# Altium schematic sheet Break Light Schematic.SchDoc
size 381 x 241 mm
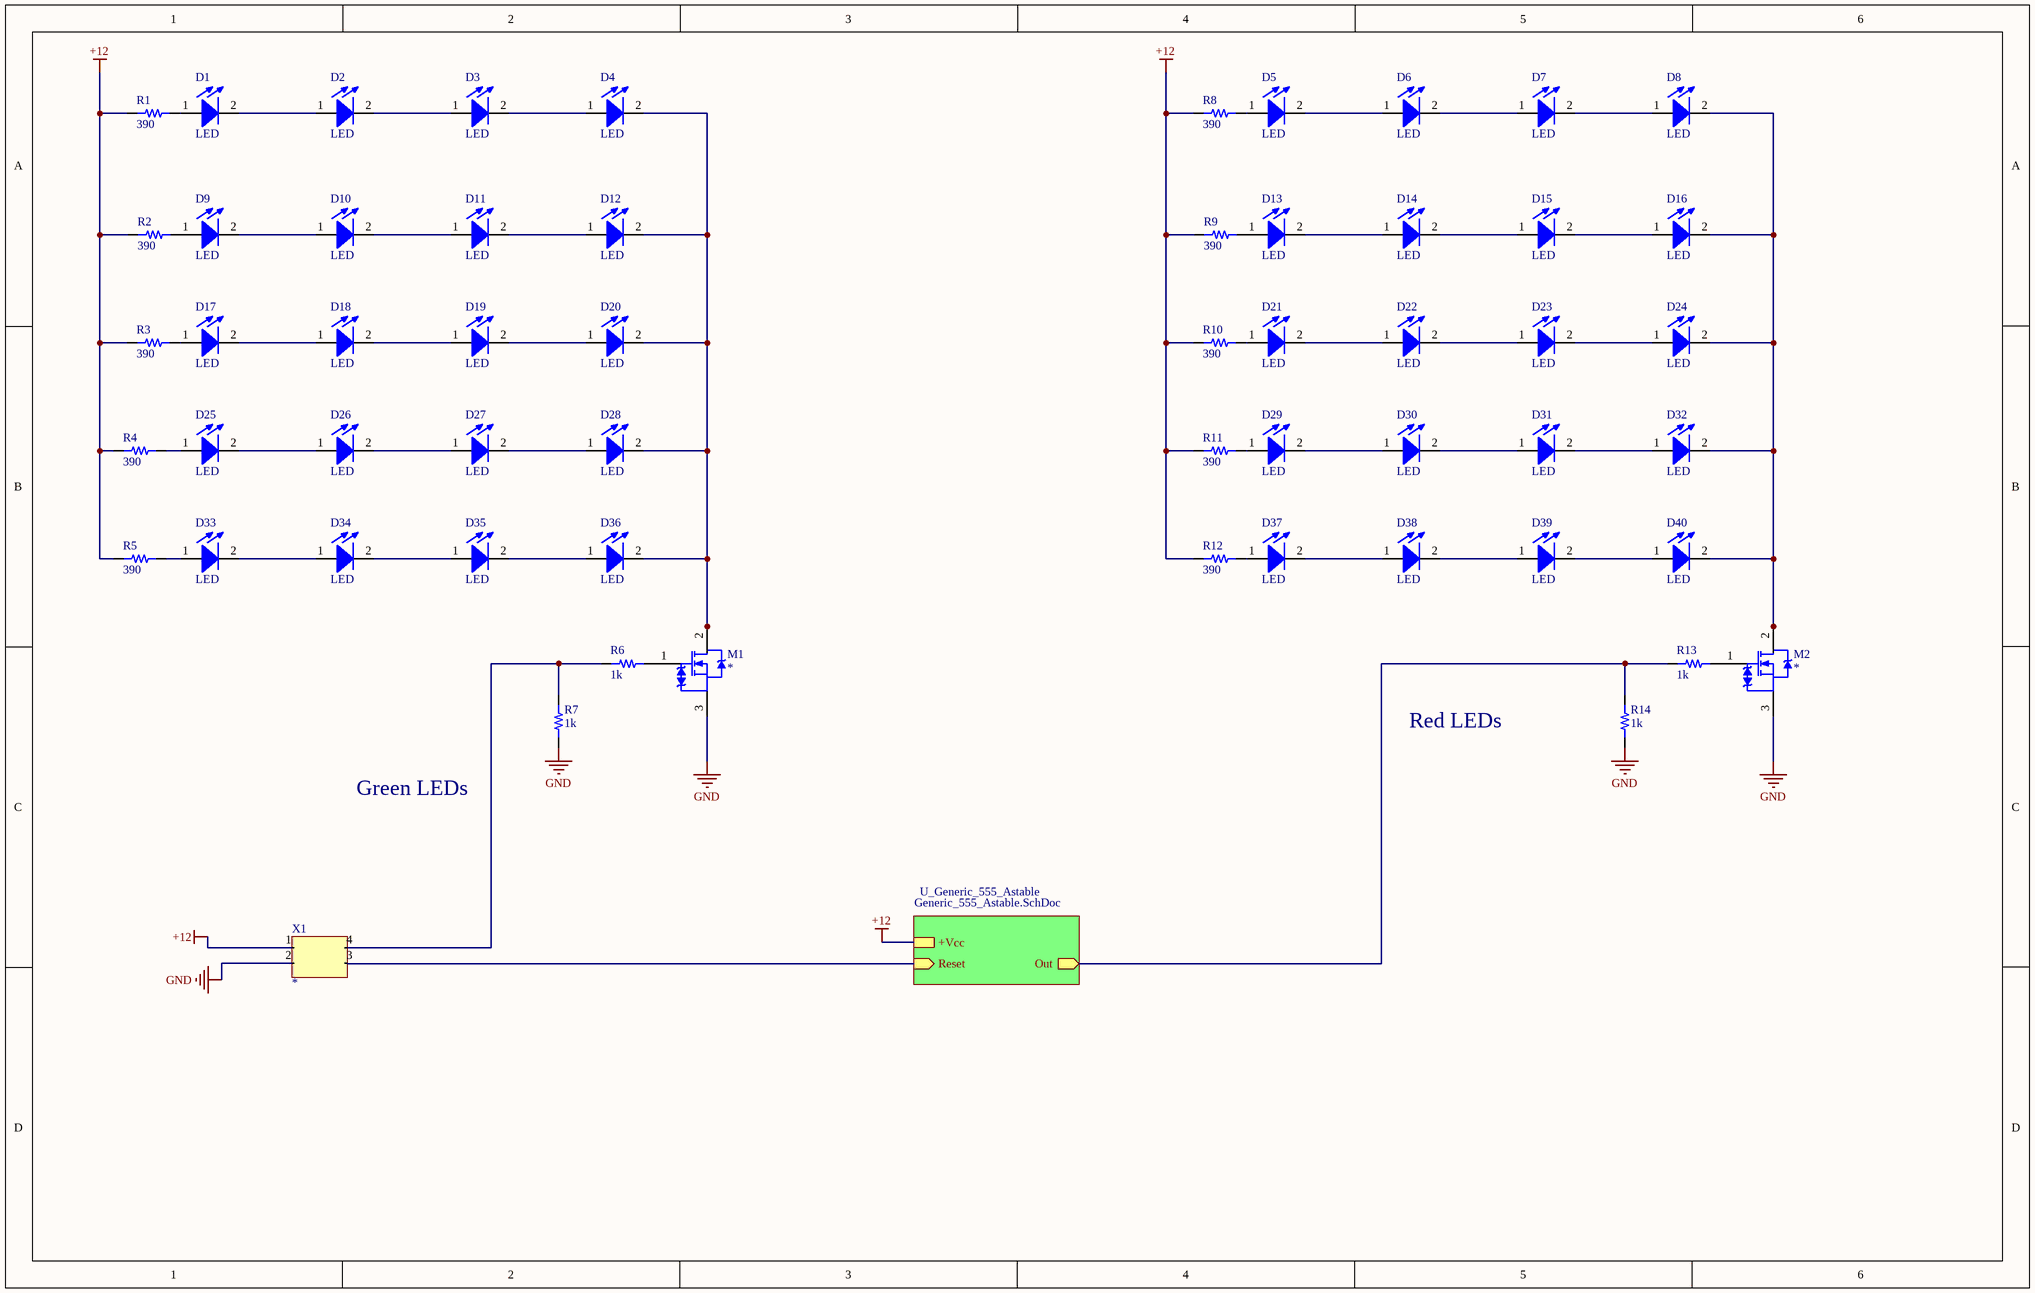
[diagram p0: Break Light Schematic.SchDoc]

## Parts
D1  LED  [LED TH]
D2  LED  [LED TH]
D3  LED  [LED TH]
D4  LED  [LED TH]
D5  LED  [LED TH]
D6  LED  [LED TH]
D7  LED  [LED TH]
D8  LED  [LED TH]
D9  LED  [LED TH]
D10  LED  [LED TH]
D11  LED  [LED TH]
D12  LED  [LED TH]
D13  LED  [LED TH]
D14  LED  [LED TH]
D15  LED  [LED TH]
D16  LED  [LED TH]
D17  LED  [LED TH]
D18  LED  [LED TH]
D19  LED  [LED TH]
D20  LED  [LED TH]
D21  LED  [LED TH]
D22  LED  [LED TH]
D23  LED  [LED TH]
D24  LED  [LED TH]
D25  LED  [LED TH]
D26  LED  [LED TH]
D27  LED  [LED TH]
D28  LED  [LED TH]
D29  LED  [LED TH]
D30  LED  [LED TH]
D31  LED  [LED TH]
D32  LED  [LED TH]
D33  LED  [LED TH]
D34  LED  [LED TH]
D35  LED  [LED TH]
D36  LED  [LED TH]
D37  LED  [LED TH]
D38  LED  [LED TH]
D39  LED  [LED TH]
D40  LED  [LED TH]
M1  *  [SOT-223-3]
M2  *  [SOT-223-3]
R1  390  [RES 0603/1608]
R2  390  [RES 0603/1608]
R3  390  [RES 0603/1608]
R4  390  [RES 0603/1608]
R5  390  [RES 0603/1608]
R6  1k  [RES 0603/1608]
R7  1k  [RES 0603/1608]
R8  390  [RES 0603/1608]
R9  390  [RES 0603/1608]
R10  390  [RES 0603/1608]
R11  390  [RES 0603/1608]
R12  390  [RES 0603/1608]
R13  1k  [RES 0603/1608]
R14  1k  [RES 0603/1608]
X1  *  [DT15-4P]

## Sub-sheets
U_Generic_555_Astable = Generic_555_Astable.SchDoc: +Vcc, Out (out), Reset (in)

## Nets
+12: R1.1 R2.1 R3.1 R4.1 R5.1 R8.1 R9.1 R10.1 R11.1 R12.1 X1.1 ; sheet U_Generic_555_Astable/+Vcc
GND: M1.3(S) M2.3(S) R7.1 R14.1 X1.2
NetD1_1: D1.1(A) R1.2
NetD1_2: D1.2(K) D2.1(A)
NetD2_2: D2.2(K) D3.1(A)
NetD3_2: D3.2(K) D4.1(A)
NetD4_2: D4.2(K) D12.2(K) D20.2(K) D28.2(K) D36.2(K) M1.2(D) M1.THM(D)
NetD5_1: D5.1(A) R8.2
NetD5_2: D5.2(K) D6.1(A)
NetD6_2: D6.2(K) D7.1(A)
NetD7_2: D7.2(K) D8.1(A)
NetD8_2: D8.2(K) D16.2(K) D24.2(K) D32.2(K) D40.2(K) M2.2(D) M2.THM(D)
NetD9_1: D9.1(A) R2.2
NetD9_2: D9.2(K) D10.1(A)
NetD10_2: D10.2(K) D11.1(A)
NetD11_2: D11.2(K) D12.1(A)
NetD13_1: D13.1(A) R9.2
NetD13_2: D13.2(K) D14.1(A)
NetD14_2: D14.2(K) D15.1(A)
NetD15_2: D15.2(K) D16.1(A)
NetD17_1: D17.1(A) R3.2
NetD17_2: D17.2(K) D18.1(A)
NetD18_2: D18.2(K) D19.1(A)
NetD19_2: D19.2(K) D20.1(A)
NetD21_1: D21.1(A) R10.2
NetD21_2: D21.2(K) D22.1(A)
NetD22_2: D22.2(K) D23.1(A)
NetD23_2: D23.2(K) D24.1(A)
NetD25_1: D25.1(A) R4.2
NetD25_2: D25.2(K) D26.1(A)
NetD26_2: D26.2(K) D27.1(A)
NetD27_2: D27.2(K) D28.1(A)
NetD29_1: D29.1(A) R11.2
NetD29_2: D29.2(K) D30.1(A)
NetD30_2: D30.2(K) D31.1(A)
NetD31_2: D31.2(K) D32.1(A)
NetD33_1: D33.1(A) R5.2
NetD33_2: D33.2(K) D34.1(A)
NetD34_2: D34.2(K) D35.1(A)
NetD35_2: D35.2(K) D36.1(A)
NetD37_1: D37.1(A) R12.2
NetD37_2: D37.2(K) D38.1(A)
NetD38_2: D38.2(K) D39.1(A)
NetD39_2: D39.2(K) D40.1(A)
NetM1_1: M1.1(G) R6.2
NetM2_1: M2.1(G) R13.2
NetR6_1: R6.1 R7.2 X1.4
NetR13_1: R13.1 R14.2 ; sheet U_Generic_555_Astable/Out
NetX1_3: X1.3 ; sheet U_Generic_555_Astable/Reset

## Notes on the sheet
- Red LEDs
- Green LEDs

## Library data of the parts
D1-D40 = 23: Thru Hole LED; id: 23
M1 M2 = 20: N-Channel 450V 600mA (Tc) 3W (Ta) Surface Mo; id: 20; vdsmax: 0; numcircuits: 1; current: 0.6A; rdson: 3.3Ohm; vt: 3.75; vgsmax: 30; MfrPartNo: *; name: STN3N45K3; type: N_Channel; package: SOT-223-3; quantity: 0; link: https://www.digikey.com/product-detail/en/stmicroelectronics/STN3N45K3/497-10649-1-ND/2346728
R1-R14 = 1: id: 1; name: 0603 Resistor; percent tolerance: 5; package: 0603; quantity: 0
  R1-R5 R8-R12: resistance: 390
  R6 R7 R13 R14: resistance: 1k
X1 = 32: DT15-4P Connector for Brakelight; id: 32; numcontacts: 4; numrows: 2; pitch: 9.12mm; MfrPartNo: *; name: DT15-4P; quantity: 0; link: https://www.te.com/usa-en/product-DT15-4P.html?source=header-match; createdby: Andrew